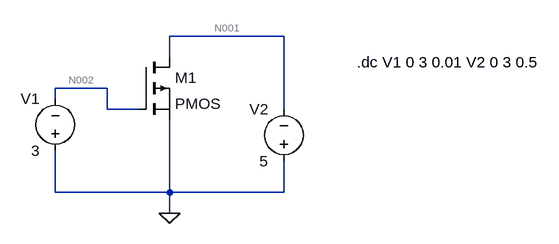
[diagram p0: schematic Assignment2_sim6.asc]
Assignment2_sim6.asc, the LTspice schematic file:
Version 4
SHEET 1 880 680
WIRE 400 64 224 64
WIRE 224 96 224 64
WIRE 128 144 48 144
WIRE 48 160 48 144
WIRE 128 176 128 144
WIRE 176 176 128 176
WIRE 400 176 400 64
WIRE 48 304 48 240
WIRE 224 304 224 192
WIRE 224 304 48 304
WIRE 400 304 400 256
WIRE 400 304 224 304
WIRE 224 336 224 304
FLAG 224 336 0
SYMBOL pmos 176 96 R0
SYMATTR InstName M1
SYMBOL voltage 48 256 R180
WINDOW 0 24 96 Left 2
WINDOW 3 24 16 Left 2
WINDOW 123 0 0 Left 0
WINDOW 39 0 0 Left 0
SYMATTR InstName V1
SYMATTR Value 3
SYMBOL voltage 400 272 R180
WINDOW 0 24 96 Left 2
WINDOW 3 24 16 Left 2
WINDOW 123 0 0 Left 0
WINDOW 39 0 0 Left 0
SYMATTR InstName V2
SYMATTR Value 5
TEXT 512 104 Left 2 !.dc V1 0 3 0.01 V2 0 3 0.5

The netlist it stands for:
* Assignment2_sim6.asc
M1 N001 N002 0 0 PMOS
V1 0 N002 3
V2 0 N001 5
.model NMOS NMOS
.model PMOS PMOS
.lib standard.mos
.dc V1 0 3 0.01 V2 0 3 0.5
.backanno
.end

* Results of the author's LTspice run, read from the files saved beside the schematic
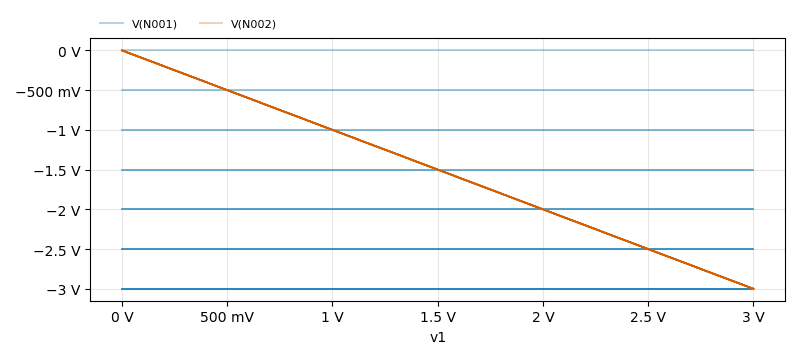
[diagram p1: DC transfer characteristic of Assignment2_sim6.asc, plotted from the saved traces]
* DC transfer characteristic, 7 runs:
*   V(N001) [v2=0]: 0 V at v1=0 V, 0 V at v1=3 V, min 0 V, max 0 V
*   V(N001) [v2=0.5]: -500 mV at v1=0 V, -500 mV at v1=3 V, min -500 mV, max -500 mV
*   V(N001) [v2=1]: -1 V at v1=0 V, -1 V at v1=3 V, min -1 V, max -1 V
*   V(N001) [v2=1.5]: -1.5 V at v1=0 V, -1.5 V at v1=3 V, min -1.5 V, max -1.5 V
*   V(N001) [v2=2]: -2 V at v1=0 V, -2 V at v1=3 V, min -2 V, max -2 V
*   V(N001) [v2=2.5]: -2.5 V at v1=0 V, -2.5 V at v1=3 V, min -2.5 V, max -2.5 V
*   V(N001) [v2=3]: -3 V at v1=0 V, -3 V at v1=3 V, min -3 V, max -3 V
*   V(N002) [v2=0]: 0 V at v1=0 V, -3 V at v1=3 V, min -3 V, max 0 V
*   V(N002) [v2=0.5]: 0 V at v1=0 V, -3 V at v1=3 V, min -3 V, max 0 V
*   V(N002) [v2=1]: 0 V at v1=0 V, -3 V at v1=3 V, min -3 V, max 0 V
*   V(N002) [v2=1.5]: 0 V at v1=0 V, -3 V at v1=3 V, min -3 V, max 0 V
*   V(N002) [v2=2]: 0 V at v1=0 V, -3 V at v1=3 V, min -3 V, max 0 V
*   V(N002) [v2=2.5]: 0 V at v1=0 V, -3 V at v1=3 V, min -3 V, max 0 V
*   V(N002) [v2=3]: 0 V at v1=0 V, -3 V at v1=3 V, min -3 V, max 0 V